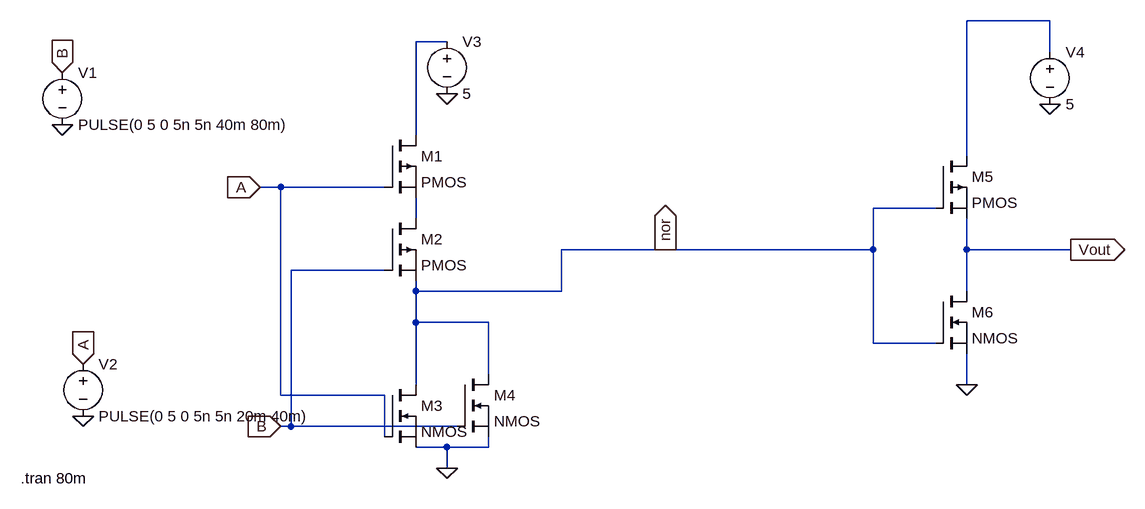
[diagram p0: schematic noe (or using nor).asc]
noe (or using nor).asc, the LTspice schematic file:
Version 4
SHEET 1 1280 680
WIRE 1136 -96 1008 -96
WIRE 208 -64 160 -64
WIRE 1136 -48 1136 -96
WIRE 160 80 160 -64
WIRE 1008 112 1008 -96
WIRE -48 160 -80 160
WIRE 112 160 -48 160
WIRE 960 192 864 192
WIRE 160 208 160 176
WIRE 544 256 384 256
WIRE 864 256 864 192
WIRE 864 256 544 256
WIRE 1008 256 1008 208
WIRE 1168 256 1008 256
WIRE 112 288 -32 288
WIRE 160 320 160 304
WIRE 384 320 384 256
WIRE 384 320 160 320
WIRE 1008 320 1008 256
WIRE 160 368 160 320
WIRE 272 368 160 368
WIRE 864 400 864 256
WIRE 960 400 864 400
WIRE 272 448 272 368
WIRE 160 464 160 368
WIRE 1008 464 1008 416
WIRE -48 480 -48 160
WIRE 112 480 -48 480
WIRE -32 528 -32 288
WIRE -32 528 -48 528
WIRE 224 528 -32 528
WIRE 112 544 112 480
WIRE 208 560 160 560
WIRE 272 560 272 544
WIRE 272 560 208 560
WIRE 208 592 208 560
FLAG -80 160 A
IOPIN -80 160 In
FLAG -48 528 B
IOPIN -48 528 In
FLAG -384 -16 B
IOPIN -384 -16 In
FLAG -384 64 0
FLAG -352 512 0
FLAG -352 432 A
IOPIN -352 432 In
FLAG 208 16 0
FLAG 1136 32 0
FLAG 1168 256 Vout
IOPIN 1168 256 Out
FLAG 1008 464 0
FLAG 544 256 nor
IOPIN 544 256 Out
FLAG 208 592 0
SYMBOL pmos 112 80 R0
SYMATTR InstName M1
SYMBOL pmos 112 208 R0
SYMATTR InstName M2
SYMBOL nmos 112 464 R0
SYMATTR InstName M3
SYMBOL nmos 224 448 R0
SYMATTR InstName M4
SYMBOL voltage -384 -32 R0
WINDOW 123 0 0 Left 0
WINDOW 39 0 0 Left 0
SYMATTR InstName V1
SYMATTR Value PULSE(0 5 0 5n 5n 40m 80m)
SYMBOL voltage -352 416 R0
SYMATTR InstName V2
SYMATTR Value PULSE(0 5 0 5n 5n 20m 40m)
SYMBOL voltage 208 -80 R0
SYMATTR InstName V3
SYMATTR Value 5
SYMBOL pmos 960 112 R0
SYMATTR InstName M5
SYMBOL nmos 960 320 R0
SYMATTR InstName M6
SYMBOL voltage 1136 -64 R0
SYMATTR InstName V4
SYMATTR Value 5
TEXT -448 608 Left 2 !.tran 80m

The netlist it stands for:
* noe (or using nor).asc
M1 N002 A N003 N003 PMOS
M2 N003 B nor nor PMOS
M3 nor A 0 0 NMOS
M4 nor B 0 0 NMOS
V1 B 0 PULSE(0 5 0 5n 5n 40m 80m)
V2 A 0 PULSE(0 5 0 5n 5n 20m 40m)
V3 N002 0 5
M5 N001 nor Vout Vout PMOS
M6 Vout nor 0 0 NMOS
V4 N001 0 5
.model NMOS NMOS
.model PMOS PMOS
.lib standard.mos
.tran 80m
.backanno
.end